# EasyEDA schematic 1-Schematic_TL071-dop.json
TITLE: TL072; REV: 1.0; Date: 2022-04-28; Sheet: 1/1; Drawn By: BH2VGM; Company: NEU-ISE
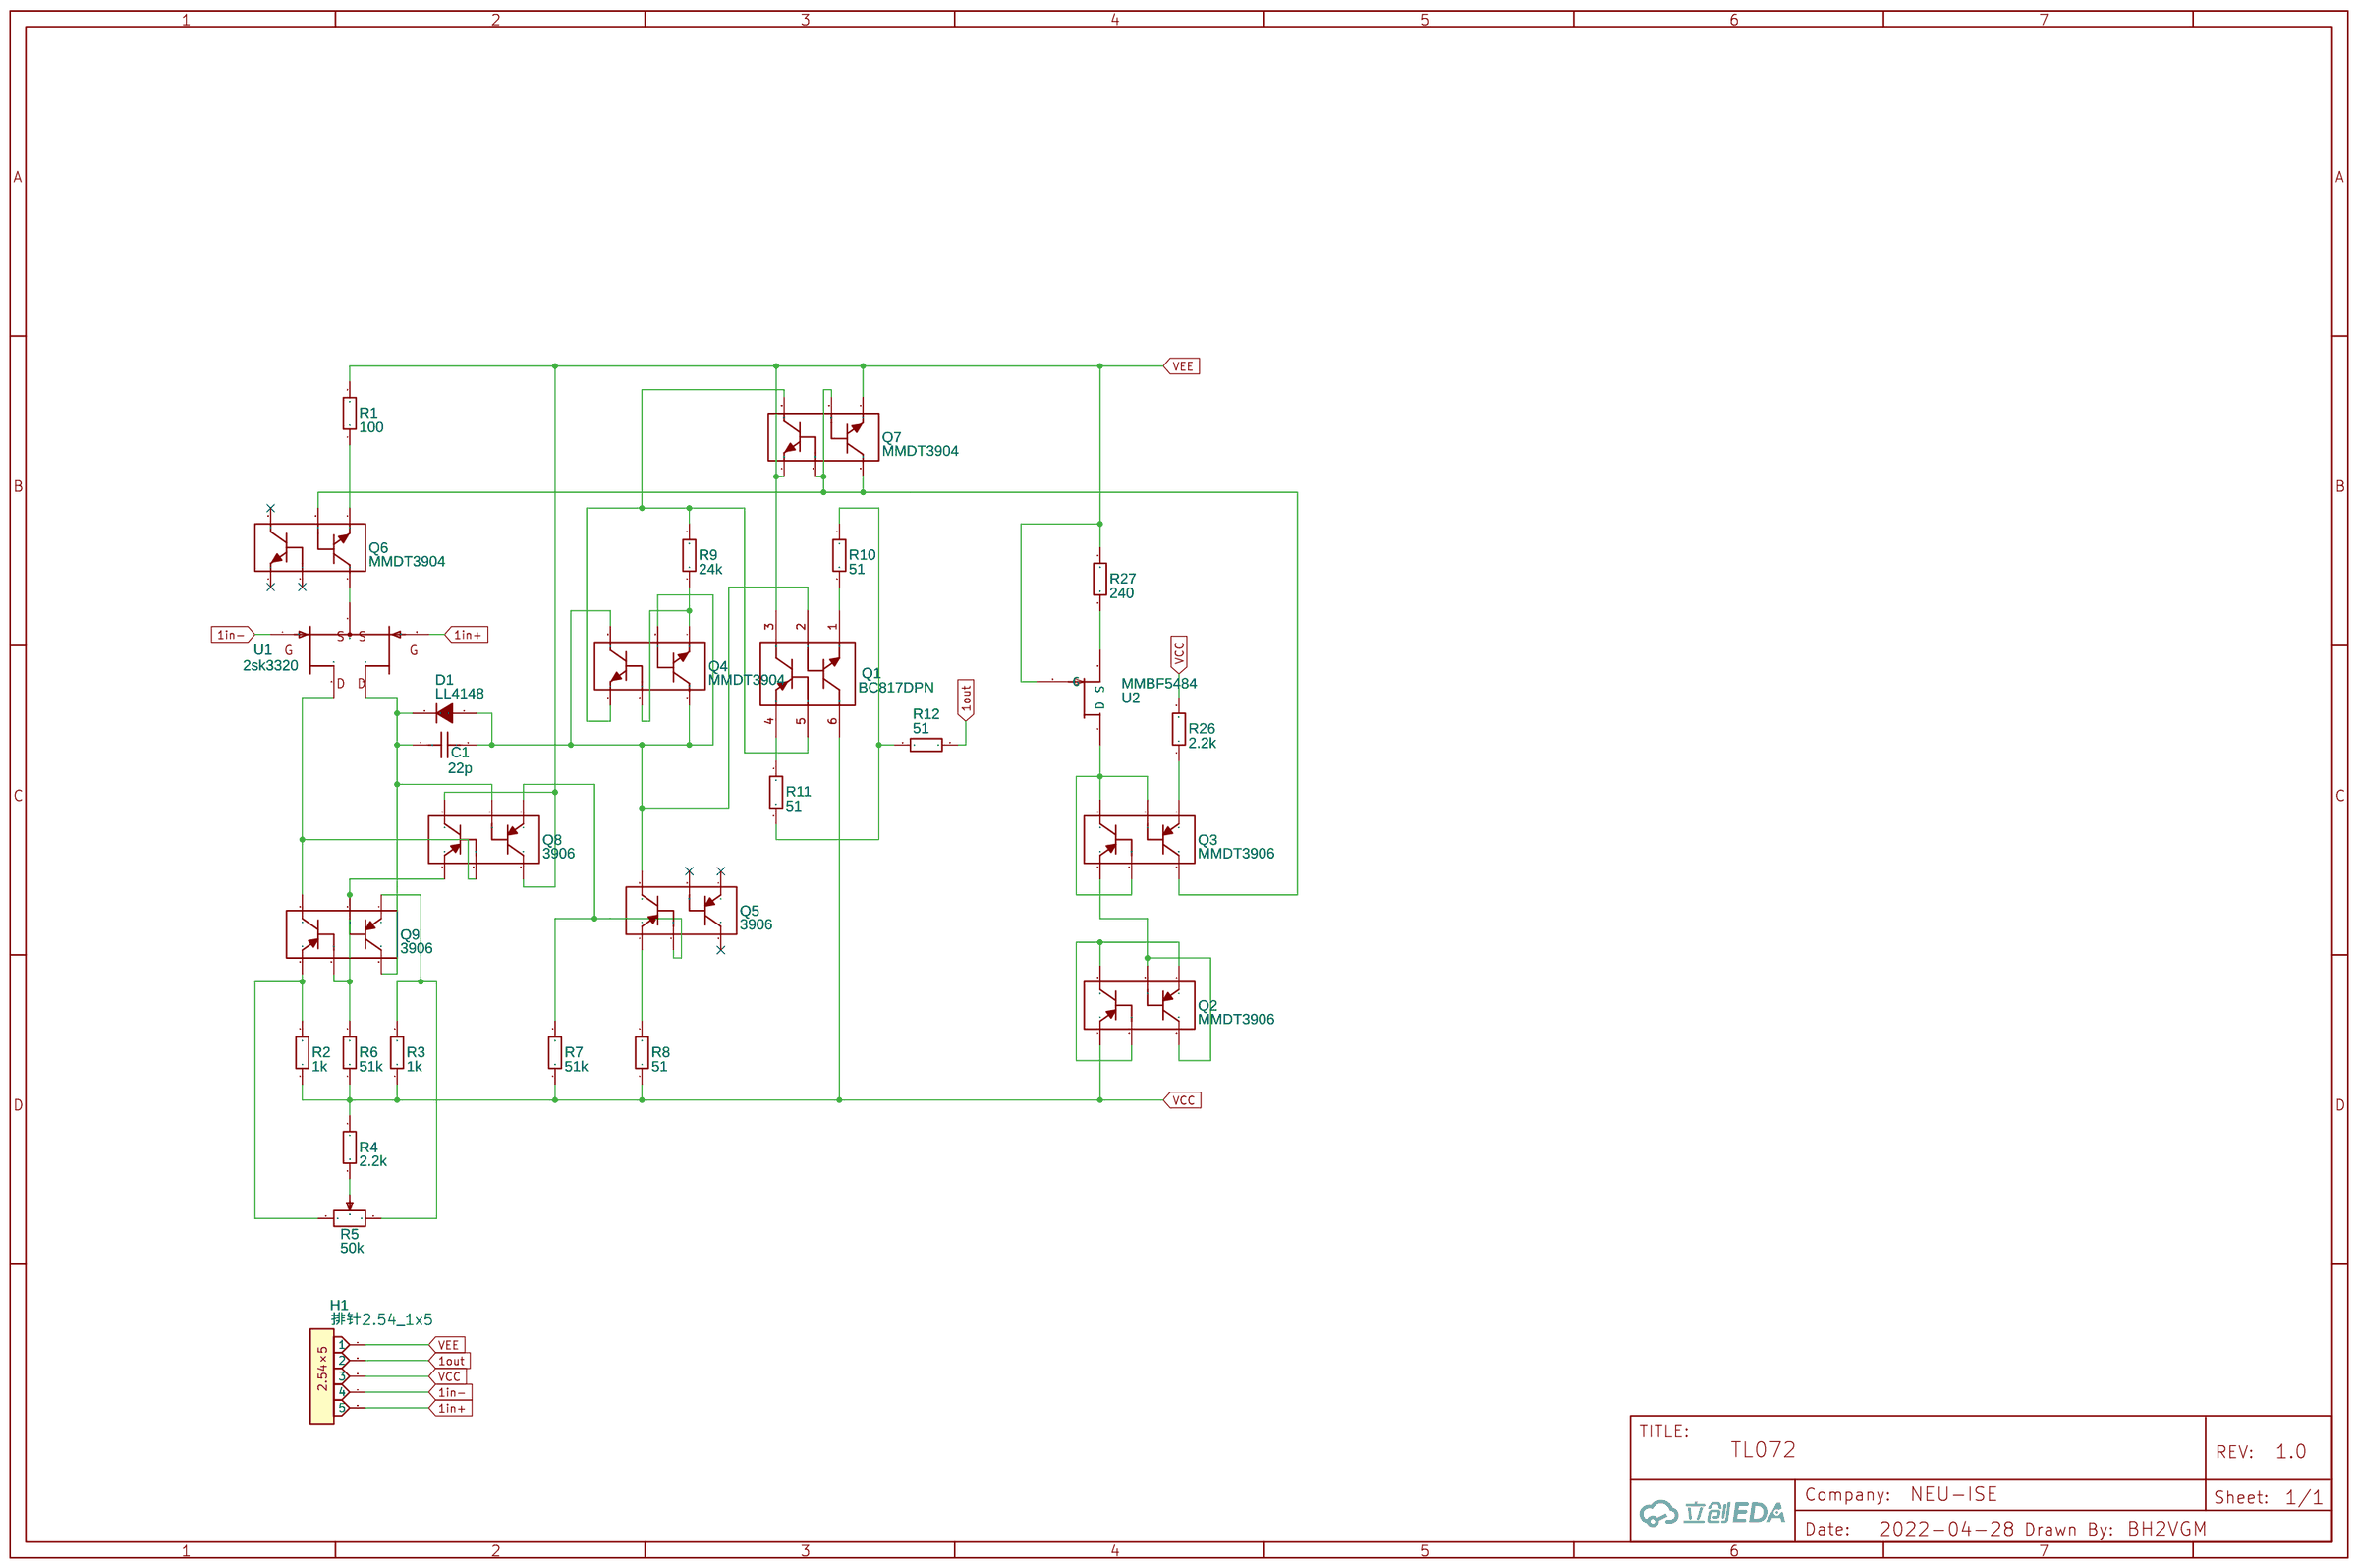
[diagram p0: schematic sheet]

## Parts
C1  22p  [C0603]
D1  LL4148  [SOD-80]
H1  排针2.54_1x5  [HDR-TH_5P-P2.54-V-M-1.7-1.1]
Q1  BC817DPN  [SOT-457_L2.9-W1.5-P0.95-LS2.8-BL]
Q2  MMDT3906  [SOT-363]
Q3  MMDT3906  [SOT-363]
Q4  MMDT3904  [SOT-363]
Q5  3906  [SOT-363]
Q6  MMDT3904  [SOT-363]
Q7  MMDT3904  [SOT-363]
Q8  3906  [SOT-363]
Q9  3906  [SOT-363]
R1  100  [R0603]
R2  1k  [R0603]
R3  1k  [R0603]
R4  2.2k  [R0603]
R5  50k  [3296W 10ROUND]
R6  51k  [R0603]
R7  51k  [R0603]
R8  51  [R0603]
R9  24k  [R0603]
R10  51  [R0603]
R11  51  [R0603]
R12  51  [R0603]
R26  2.2k  [R0603]
R27  240  [R0603]
U1  2sk3320  [SOT-353-5_L2.0-W1.3-P0.65-TL]
U2  MMBF5484  [SOT-23_L2.9-W1.3-P1.90-LS2.4-BR]

## Library data of the parts
C1 = C0805X7R103J500NT: Supplier: LCSC; Supplier Part: C2835540; Manufacturer: SANYEAR(叁叶源); JLCPCB Part Class: Extended Part; Contributor: LCSC
D1 = LL4148: Supplier: LCSC; Manufacturer: VISHAY; Manufacturer Part: LL4148-GS08; Supplier Part: C68883; JLCPCB Part Class: Extended Part; Contributor: king13478509115
H1 = 排针2.54_1x5: Supplier: LCSC; Supplier Part: C358687; Manufacturer: MINTRON; Manufacturer Part: MTP125-1105S1; Contributor: WOSHI6666444444; JLCPCB Part Class: Extended Part
Q1 = BC817DPN_R1_00001: Supplier: LCSC; Supplier Part: C696397; Manufacturer: PANJIT(强茂); Contributor: LCSC; JLCPCB Part Class: Extended Part
Q2 Q3 Q5 Q8 Q9 = MMDT3906: Supplier: LCSC; Supplier Part: C779248; Manufacturer: MCC(Micro Commercial Components); Manufacturer Part: MMDT3906-TP; Contributor: king13478509115; JLCPCB Part Class: Extended Part
Q4 Q6 Q7 = MMDT3904: Supplier: LCSC; Manufacturer: DIODES; Manufacturer Part: MMDT3904-7-F; Supplier Part: C83572; JLCPCB Part Class: Extended Part; Contributor: king13478509115
R1-R4 R6-R12 R26 R27 = 0805: Supplier: LCSC; Supplier Part: C9900012715; Manufacturer: null; link: https://atta.szlcsc.comnull; Contributor: LCSC; JLCPCB Part Class: Extended Part
R5 = 3296W: Supplier: LCSC; Manufacturer: BOURNS; Manufacturer Part: 3296W-1-103LF; Supplier Part: C34846; Resistance(Ohms): 10K; Resistance (Ohms): 10K; JLCPCB Part Class: Extended Part; Contributor: king13478509115
U1 = 2sk3320: Contributor: king13478509115
U2 = MMBF5484: Supplier: LCSC; Supplier Part: C274687; Manufacturer: ON Semicon; Contributor: king13478509115; JLCPCB Part Class: Extended Part

## Nets
VCC: H1.3 Q1.6(C1) Q2.1(E) R2.1 R3.1 R4.1 R6.1 R7.1 R8.1 R26.2
VEE: H1.1 Q1.3(C2) Q7.1(E) Q7.4(E) Q8.3(C) Q8.6(C) R1.2 R27.1 U2.3(G)
1in+: H1.5 U1.5(G)
1in-: H1.4 U1.4(G)
1out: H1.2 R12.1
Net-(C1-1): C1.1 D1.1(C) Q8.5(B) Q9.3(C) U1.1(D)
Net-(C1-2): C1.2 D1.2(A) Q1.2(B1) Q4.3(C) Q4.5(B) Q4.6(C) Q5.6(C)
Net-(Q1-1): Q1.1(E1) R10.2
Net-(Q1-4): Q1.4(E2) R11.1
Net-(Q1-5): Q1.5(B2) Q4.1(E) Q7.6(C) R9.2
Net-(Q2-2): Q2.2(B) Q2.4(E) Q2.6(C)
Net-(Q2-3): Q2.3(C) Q2.5(B) Q3.1(E)
Net-(Q3-2): Q3.2(B) Q3.5(B) Q3.6(C) U2.1(D)
Net-(Q3-3): Q3.3(C) Q6.5(B) Q7.2(B) Q7.3(C) Q7.5(B)
Net-(Q3-4): Q3.4(E) R26.1
Net-(Q4-2): Q4.2(B) Q4.4(E) R9.1
Net-(Q5-1): Q5.1(E) R8.2
Net-(Q5-2): Q5.2(B) Q8.4(E) R7.2
Net-(Q6-3): Q6.3(C) U1.2(S)
Net-(Q6-4): Q6.4(E) R1.1
Net-(Q8-1): Q8.1(E) Q9.2(B) Q9.5(B) R6.2
Net-(Q8-2): Q8.2(B) Q9.6(C) U1.3(D)
Net-(Q9-1): Q9.1(E) R2.2 R5.3
Net-(Q9-4): Q9.4(E) R3.2 R5.1
Net-(R4-2): R4.2 R5.2
Net-(R10-1): R10.1 R11.2 R12.2
Net-(R27-2): R27.2 U2.2(S)

Not connected (* = marked no-connect by the designer): Q5 3(C)* 4(E)* 5(B)*; Q6 1(E)* 2(B)* 6(C)*
